# EasyEDA Pro project Schematics with ESP32 .eprj

# Schematic Schematic1

## Sheets
1 Part B(1): Board Name: Board1; Create Date: 2026-05-07; Page Name: P1; Project Name: Schematics with ESP32; Schematic Name: Schematic1; Update Date: 2026-05-08; Company: EasyEDA.com; Page Size: A4; Version: V1.0
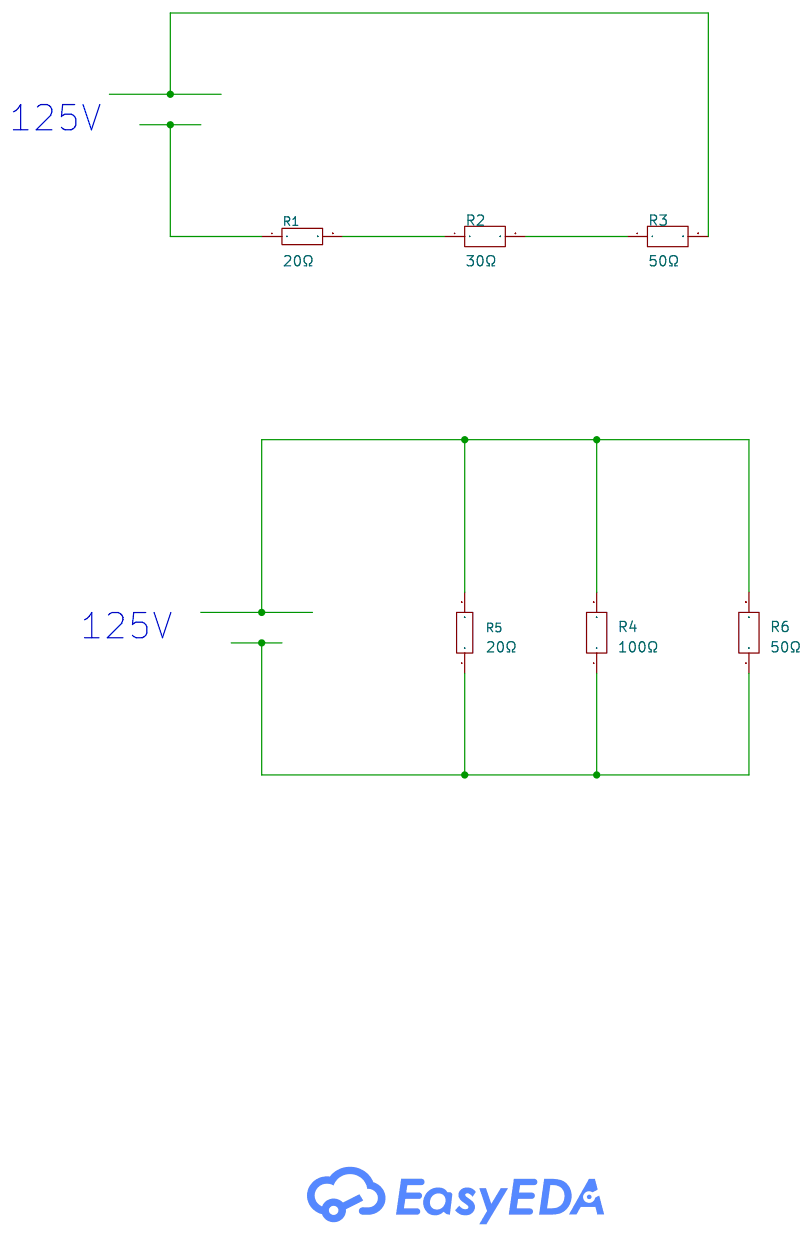
[diagram p0: Part B(1)]
2 Part B(2): Create Date: 2026-05-10; Page Name: Part B(2); Update Date: 2026-05-11
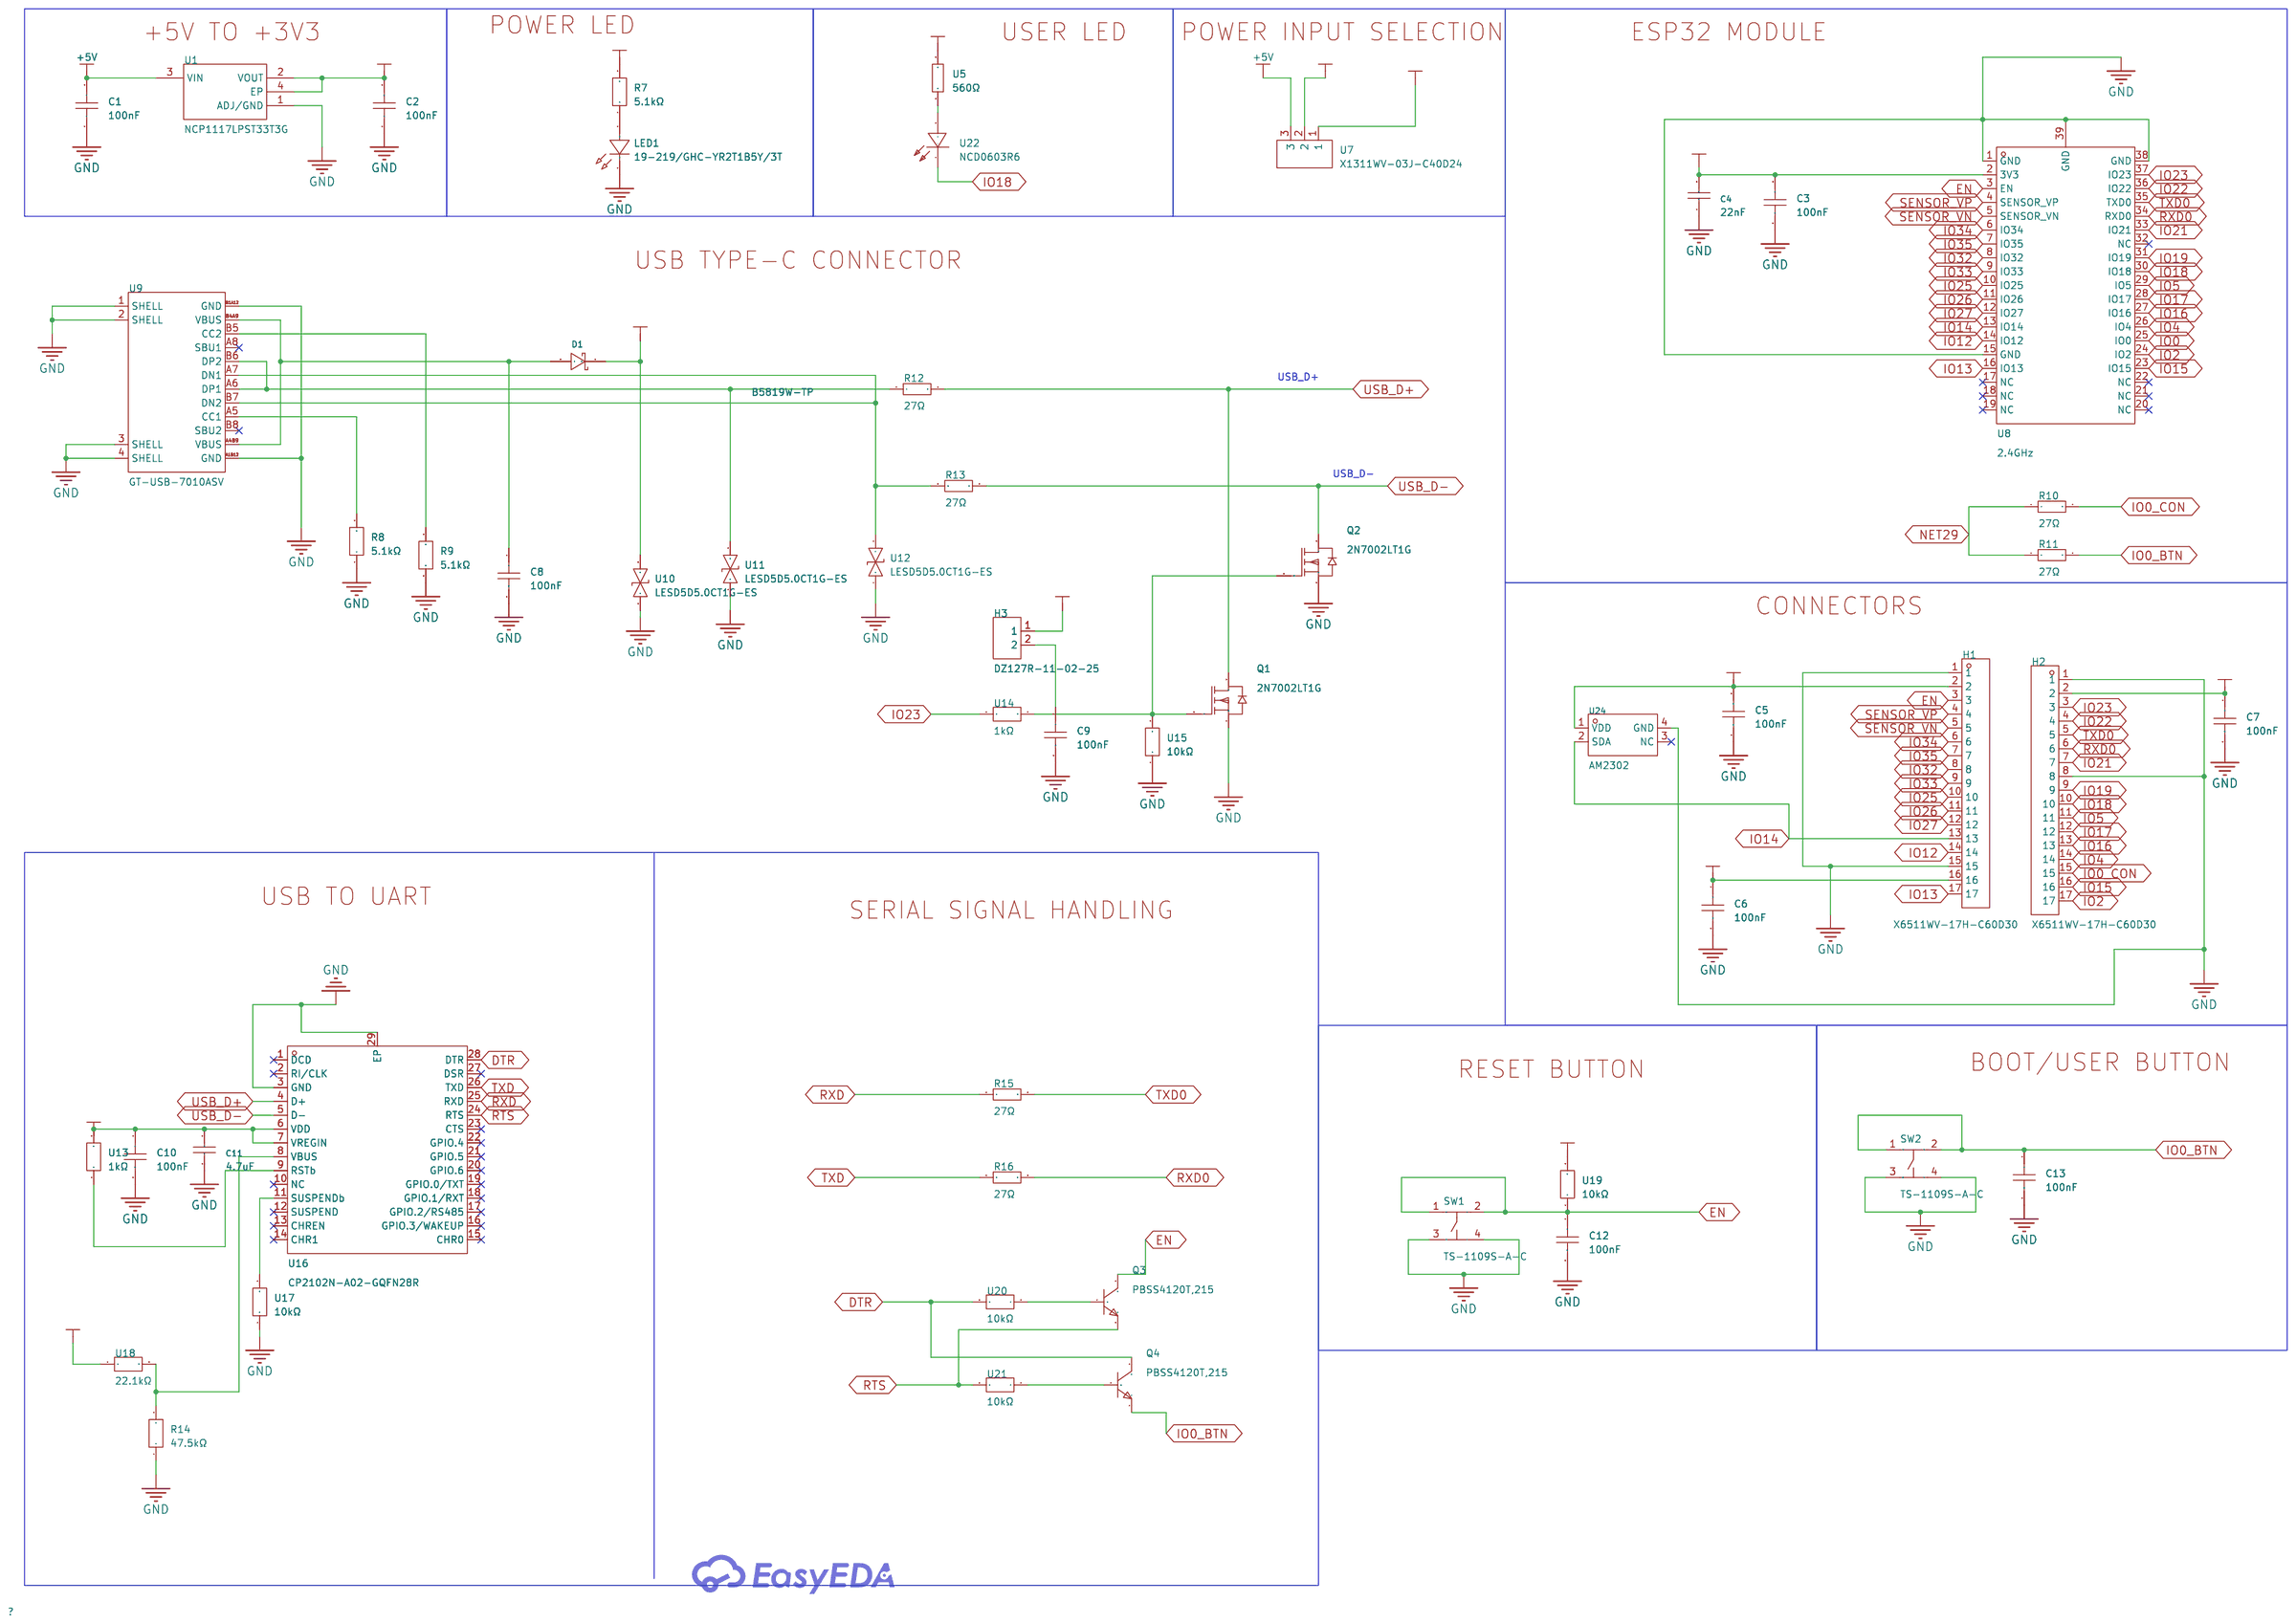
[diagram p1: Part B(2)]

## Parts
sheet Part B(1)
R1  20Ω  [R0805]
R2  30Ω  [R0805]
R3  50Ω  [R0805]
R4  100Ω  [R0805]
R5  20Ω  [R0603]
R6  50Ω  [R0805]
sheet Part B(2)
C1  100nF  [C0603]
C2  100nF  [C0603]
C3  100nF  [C0603]
C4  22nF  [C0603]
C5  100nF  [C0603]
C6  100nF  [C0603]
C7  100nF  [C0603]
C8  100nF  [C0603]
C9  100nF  [C0603]
C10  100nF  [C0603]
C11  4.7uF  [C0603]
C12  100nF  [C0603]
C13  100nF  [C0603]
D1  B5819W-TP  [SOD-123_L2.8-W1.8-LS3.7-RD]
H1  X6511WV-17H-C60D30  [HDR-TH_17P-P2.54-V-M]
H2  X6511WV-17H-C60D30  [HDR-TH_17P-P2.54-V-M]
H3  DZ127R-11-02-25  [HDR-TH_2P-P1.27-V-M]
LED1  19-219/GHC-YR2T1B5Y/3T  [LED-SMD_L1.6-W0.8_19-219-GHC-YR2T1B5Y-3T]
Q1  2N7002LT1G  [SOT-23_L2.9-W1.3-P1.90-LS2.4-BR]
Q2  2N7002LT1G  [SOT-23_L2.9-W1.3-P1.90-LS2.4-BR]
Q3  PBSS4120T,215  [SOT-23-3_L2.9-W1.3-P1.90-LS2.4-BR]
Q4  PBSS4120T,215  [SOT-23-3_L2.9-W1.3-P1.90-LS2.4-BR]
R7  5.1kΩ  [RES-TH_BD4.5-L11.5-P15.50-D0.7]
R8  5.1kΩ  [RES-TH_BD4.5-L11.5-P15.50-D0.7]
R9  5.1kΩ  [RES-TH_BD4.5-L11.5-P15.50-D0.7]
R10  27Ω  [RES-TH_BD4.0-L11.5-P15.50-D0.7]
R11  27Ω  [RES-TH_BD4.0-L11.5-P15.50-D0.7]
R12  27Ω  [RES-TH_BD4.0-L11.5-P15.50-D0.7]
R13  27Ω  [RES-TH_BD4.0-L11.5-P15.50-D0.7]
R14  47.5kΩ  [RES-TH_BD2.4-L6.3-P10.30-D0.6]
R15  27Ω  [RES-TH_BD4.0-L11.5-P15.50-D0.7]
R16  27Ω  [RES-TH_BD4.0-L11.5-P15.50-D0.7]
SW1  TS-1109S-A-C  [KEY-SMD_4P-L4.5-W4.5-P3.00-LS7.0]
SW2  TS-1109S-A-C  [KEY-SMD_4P-L4.5-W4.5-P3.00-LS7.0]
U1  NCP1117LPST33T3G  [SOT-223_L6.5-W3.5-P2.30-LS7.0-BR]
U5  560Ω  [RES-TH_BD4.5-L11.5-P15.50-D0.8]
U7  X1311WV-03J-C40D24  [HDR-TH_3P-P1.27-V-M]
U8  2.4GHz  [WIFI-SMD_ESP32-WROOM-32E]
U9  GT-USB-7010ASV  [LED0805-FD_KSM0508PT24MIL]
U10  LESD5D5.0CT1G-ES  [SOD-523_L1.2-W0.8-LS1.6-BI]
U11  LESD5D5.0CT1G-ES  [SOD-523_L1.2-W0.8-LS1.6-BI]
U12  LESD5D5.0CT1G-ES  [SOD-523_L1.2-W0.8-LS1.6-BI]
U13  1kΩ  [RES-TH_BD4.5-L11.5-P15.50-D0.6]
U14  1kΩ  [RES-TH_BD4.5-L11.5-P15.50-D0.6]
U15  10kΩ  [RES-TH_2P-L22.0-W9.5-BL]
U16  CP2102N-A02-GQFN28R  [QFN-28_L5.0-W5.0-P0.50-TL-EP3.3]
U17  10kΩ  [RES-TH_2P-L22.0-W9.5-BL]
U18  22.1kΩ  [RES-TH_BD3.2-L9.0-P13.00-D0.5]
U19  10kΩ  [RES-TH_2P-L22.0-W9.5-BL]
U20  10kΩ  [RES-TH_2P-L22.0-W9.5-BL]
U21  10kΩ  [RES-TH_2P-L22.0-W9.5-BL]
U22  NCD0603R6  [LED0805-RD_RED]
U24  AM2302  [SENSOR-TH_AM2302]

## Library data of the parts
R1 = 0805W8J0200T5E: LCSC Part Name: 20Ω ±5% 125mW 厚膜电阻; Supplier Part: C25293; Manufacturer: UNI-ROYAL(厚声); Supplier Footprint: 0805; JLCPCB Part Class: Extended Part; Datasheet: https://item.szlcsc.com/datasheet/0805W8J0200T5E/26036.html; Supplier: LCSC; Type: Thick Film Resistor; Tolerance: ±5%; Power(Watts): 125mW; Voltage-Supply(Max): 150V; Temperature Coefficient: ±200ppm/℃; Operating Temperature: -55℃~+155℃
R2 = FRC0805F30R0TS: LCSC Part Name: 30Ω ±1% 125mW 厚膜电阻; Supplier Part: C2907256; Manufacturer: FOJAN(富捷); Supplier Footprint: 0805; JLCPCB Part Class: Extended Part; Supplier: LCSC; Type: Thick Film Resistor; Tolerance: ±1%; Power(Watts): 125mW; Voltage-Supply(Max): 150V; Temperature Coefficient: ±100ppm/℃; Operating Temperature: -55℃~+155℃
R3 R6 = ARG05FTC0500: LCSC Part Name: 薄膜电阻 50Ω ±1% 125mW; Supplier Part: C2828866; Manufacturer: Viking(光颉); Supplier Footprint: 0805; JLCPCB Part Class: Extended Part; Datasheet: https://atta.szlcsc.com/upload/public/pdf/source/20211009/C2828883_CAE7D170B8B230FC4A048BDC7B3A81FC.pdf; Supplier: LCSC; Type: Thin Film Resistor; Tolerance: ±1%; Temperature Coefficient: ±25ppm/℃; Operating Temperature Range: -55℃~+155℃
R4 = FRC0805J101 TS: LCSC Part Name: 100Ω ±5% 125mW 厚膜电阻; Supplier Part: C2907294; Manufacturer: FOJAN(富捷); Supplier Footprint: 0805; JLCPCB Part Class: Extended Part; Supplier: LCSC; Type: Thick Film Resistor; Tolerance: ±5%; Power(Watts): 125mW; Voltage-Supply(Max): 150V; Temperature Coefficient: ±100ppm/℃; Operating Temperature: -55℃~+155℃
R5 = 0603WAF200JT5E: LCSC Part Name: 20Ω ±1% 100mW 厚膜电阻; Supplier Part: C22950; Manufacturer: UNI-ROYAL(厚声); Supplier Footprint: 0603; JLCPCB Part Class: Basic Part; Datasheet: https://atta.szlcsc.com/upload/public/pdf/source/20200306/C422600_1E6D84923E4A46A82E41ADD87F860B5C.pdf; Supplier: LCSC; Type: Thick Film Resistors; Tolerance: ±1%; Temperature Coefficient: ±100ppm/℃; Operating Temperature Range: -55℃~+155℃
C1-C3 C5-C10 C12 C13 = CAP_0603: Supplier Footprint: 0603
C4 = CL10B223KB8NNNC: LCSC Part Name: 22nF ±10% 50V; Supplier Part: C21122; Manufacturer: SAMSUNG(三星); Supplier Footprint: 0603; JLCPCB Part Class: Basic Part; Datasheet: https://item.szlcsc.com/datasheet/CL10B223KB8NNNC/21834.html; Supplier: LCSC; Tolerance: ±10%; Voltage Rating: 50V; Temperature Coefficient: X7R
C11 = CL10A475KP8NNNC: LCSC Part Name: 4.7uF ±10% 10V; Supplier Part: C1705; Manufacturer: SAMSUNG(三星); Supplier Footprint: 0603; JLCPCB Part Class: Extended Part; Datasheet: https://item.szlcsc.com/datasheet/CL10A475KP8NNNC/2057.html; Supplier: LCSC; Tolerance: ±10%; Voltage Rating: 10V; Temperature Coefficient: X5R
D1 = B5819W-TP: LCSC Part Name: 电压:40V 电流:1A; Supplier Part: C84354; Manufacturer: MCC(美微科); Supplier Footprint: SOD-123; JLCPCB Part Class: Extended Part; Datasheet: https://item.szlcsc.com/datasheet/B5819W-TP/85524.html; Supplier: LCSC; Voltage - Forward(Vf@If): 600mV@1A; Voltage - DC Reverse(Vr): 40V; Current - Rectified: 1A; Reverse Leakage Current (Ir): 1mA@40V; Operating Junction Temperature Range: -65℃~+125℃; Non-Repetitive Peak Forward Surge Current: 10A
H1 H2 = X6511WV-17H-C60D30: LCSC Part Name: 1x17P 间距:2.54mm 方针; Supplier Part: C725949; Manufacturer: XKB Connection(中国星坤); Supplier Footprint: 插件,P=2.54mm; JLCPCB Part Class: Extended Part; Datasheet: https://item.szlcsc.com/datasheet/X6511WV-17H-C60D30/772398.html; Supplier: LCSC; Pin Structure: 1x17P; Pitch: 2.54mm; Row Spacing: 2.54mm; Circluar Pins/Square Pins: Pin Header; Number of Rows: 1; Number of Pins: 17P; Current Rating: 3A; Voltage Rating (Max): 250V; Insulation Height: 2.5mm; Contact Material: Brass; Contact Plating: Gold; Operating Temperature: -40℃~+105℃; Color: Black
H3 = DZ127R-11-02-25: LCSC Part Name: 1x2P 间距:1.27mm 方针 直插; Supplier Part: C2935942; Manufacturer: DEALON(德艺隆); Supplier Footprint: 插件,P=1.27mm; JLCPCB Part Class: Extended Part; Datasheet: https://item.szlcsc.com/datasheet/DZ127R-11-02-25/3287520.html; Supplier: LCSC; Pin Structure: 1x2P; Pitch: 1.27mm; Circluar Pins/Square Pins: Pin Header; Mounting Type: Through Hole; Number of Rows: 1; Number of Pins: 2P; Current Rating: 1A; Length of Mating Pin: 3mm; Insulation Height: 1mm; Length of End Connection Pin: 2.5mm; Contact Material: Brass; Contact Plating: Gold; Color: Black
LED1 = 19-219/GHC-YR2T1B5Y/3T: LCSC Part Name: 0603正贴式 绿灯(Iv=140~360mcd) @IF=20mA); Supplier Part: C2994781; Manufacturer: EVERLIGHT(亿光); Supplier Footprint: 0603; JLCPCB Part Class: Extended Part; Datasheet: https://www.everlighteurope.com/custom/files/datasheets/DSE-0006814.pdf; Supplier: LCSC; Illumination Color: Green; Voltage - Forward(Vf): 2.9V; Power(Watts): 95mW; Forward Current: 5mA; Wavelength - Dominant: 518nm; Peak Wavelength: 525nm; Diode Configuration: Discrete Diode; Lens Color: Water Clear; Luminous Intensity: 360mcd; Viewing Angle: 130°; Operating Temperature: -40℃~+85℃
Q1 Q2 = 2N7002LT1G: LCSC Part Name: 1个N沟道 耐压:60V 电流:115mA; Supplier Part: C16338; Manufacturer: onsemi(安森美); Supplier Footprint: SOT-23; JLCPCB Part Class: Extended Part; Datasheet: https://atta.szlcsc.com/upload/public/pdf/source/20140815/1457707218098.pdf; Supplier: LCSC; Type: 1 N-Channel; Drain Source On Resistance (RDS(on)@Vgs,Id): 7.5Ω@10V,500mA; Gate Threshold Voltage (Vgs(th)@Id): 2.5V@250uA; Input Capacitance (Ciss@Vds): 50pF@25V; Reverse Transfer Capacitance (Crss@Vds): 5pF@25V; Operating Temperature: -55℃~+150℃
Q3 Q4 = PBSS4120T,215: LCSC Part Name: NPN 电流:1A 电压:20V; Supplier Part: C455069; Manufacturer: Nexperia(安世); Supplier Footprint: SOT-23; JLCPCB Part Class: Extended Part; Datasheet: https://item.szlcsc.com/datasheet/PBSS4120T%252C215/457438.html; Supplier: LCSC; type: NPN; Current - Collector(Ic): 1A; Collector - Emitter Voltage VCEO: 20V; Pd - Power Dissipation: 480mW; DC Current Gain: 300@500mA,2V; Transition frequency(fT): 100MHz; Current - Collector Cutoff: 50uA; Vce Saturation(VCE(sat)): 250mV@1A,50mA; Operating Temperature: -65℃~+150℃; Emitter-Base Voltage(Vebo): 5V; Number: 1 NPN
R7-R9 = MF1W-5.1KΩ±1%T: LCSC Part Name: 金属膜电阻 5.1kΩ ±1% 1W; Supplier Part: C714111; Manufacturer: 华星机电; Supplier Footprint: 插件,D4.5xL11.5mm; JLCPCB Part Class: Extended Part; Datasheet: https://item.szlcsc.com/datasheet/MF1W-5.1K%25CE%25A9%25C2%25B11%2525T/754436.html; Supplier: LCSC; Type: Metal Film Resistor; Tolerance: ±1%; Power(Watts): 1W; Temperature Coefficient: ±200ppm/℃
R10-R13 R15 R16 = MF2WS-27Ω±1%: LCSC Part Name: 27Ω ±1% 2W 金属膜电阻; Supplier Part: C127253; Manufacturer: CCO(千志电子); Supplier Footprint: 插件,D4.5xL11.5mm; JLCPCB Part Class: Extended Part; Datasheet: https://atta.szlcsc.com/upload/public/pdf/source/20190910/C427326_62A6D058BC0FF74963A2F22379CA06CE.pdf; Supplier: LCSC; Type: Metal Film Resistors; Tolerance: ±1%; Voltage-Supply(Max): 350V; Power(Watts): 2W; Temperature Coefficient: ±100ppm/℃; Operating Temperature: -55℃~+155℃
R14 = RNF14BTC47K5: LCSC Part Name: 金属膜电阻 47.5kΩ ±0.1% 250mW; Supplier Part: C2592088; Manufacturer: SEI(Stackpole Electronics Inc.); Supplier Footprint: 插件,D2.4xL6.4mm; JLCPCB Part Class: Extended Part; Datasheet: https://atta.szlcsc.com/upload/public/pdf/source/20210416/CE3C3DFE1F0E2A8D22EC743938724C43.pdf; Supplier: LCSC; Type: Metal Film Resistors; Tolerance: ±0.1%; Power(Watts): 0.25W; Temperature Coefficient: ±50ppm/℃; Operating Temperature Range: -55℃~+155℃
SW1 SW2 = TS-1109S-A-C: LCSC Part Name: 4.5*4.5*4.5mm 立贴 轻触开关; Supplier Part: C2885142; Manufacturer: XKB Connection(中国星坤); Supplier Footprint: SMD-4P,4.5x4.5mm; JLCPCB Part Class: Extended Part; Datasheet: https://item.szlcsc.com/datasheet/TS-1109S-A-C/3095634.html; Supplier: LCSC; Circuit: SPST; Actuator Style: Round Button; Operating Force: 1N; Mounting Type: Surface Mount,Vertical; Length: 4.5mm; Width: 4.5mm; Switch Height: 4.5mm; with Bracket: Without Bracket; Contact Current: 50mA; Voltage Rating: 12V; Actuator/Cap Color: Black; With Lamp: No; Termination Style: Gull Wing; Life: 100,000 cycles; Operating Temperature: -30℃~+85℃
U1 = NCP1117LPST33T3G: LCSC Part Name: 输入18V 输出3.3V 1A; Supplier Part: C146799; Manufacturer: onsemi(安森美); Supplier Footprint: SOT-223; JLCPCB Part Class: Extended Part; Datasheet: https://item.szlcsc.com/datasheet/NCP1117LPST33T3G/158131.html; Supplier: LCSC; Output Type: Fixed; Voltage - Supply: 18V; Output Voltage: 3.3V; Output Current: 1A; Power Supply Rejection Ratio (PSRR): 60dB@(120Hz); Voltage Dropout: 1.3V@(1A); standby current: 550uA; Features: Over Temperature Protection；Over Current Protection; Operating Temperature: 0℃~+125℃; Output Configuration: Positive; Number of Outputs: 1
U5 = MF1W-560Ω±1% T: LCSC Part Name: 560Ω ±1% 1W 金属膜电阻; Supplier Part: C119480; Manufacturer: CCO(千志电子); Supplier Footprint: 插件,D4.5xL11.5mm; JLCPCB Part Class: Extended Part; Datasheet: https://item.szlcsc.com/datasheet/MF1W-560%25CE%25A9%25C2%25B11%2525%2520T/120749.html; Supplier: LCSC; Type: Metal Film Resistor; Tolerance: ±1%; Voltage-Supply(Max): 350V; Power(Watts): 1W; Temperature Coefficient: ±100ppm/℃; Operating Temperature: -55℃~+155℃
U7 = X1311WV-03J-C40D24: LCSC Part Name: 1x3P 间距:1.27mm 方针; Supplier Part: C5243683; Manufacturer: XKB Connection(中国星坤); Supplier Footprint: 插件,P=1.27mm; JLCPCB Part Class: Extended Part; Datasheet: https://item.szlcsc.com/datasheet/X1311WV-03J-C40D24/5952616.html; Supplier: LCSC; Pin Structure: 1x3P; Pitch: 1.27mm; Row Spacing: 1.27mm; Circluar Pins/Square Pins: Pin Header; Number of Rows: 1; Number of Pins: 3P; Current Rating: 3A; Voltage Rating (Max): 250V; Insulation Height: 1mm; Contact Material: Brass; Contact Plating: Gold; Operating Temperature: -40℃~+105℃; Color: Black
U8 = ESP32-WROOM-32E-N8: LCSC Part Name: 不带固件 通用型Wi-Fi+BT+BLE MCU模组; Supplier Part: C701342; Manufacturer: ESPRESSIF(乐鑫); Supplier Footprint: SMD,25.5x18mm; JLCPCB Part Class: Extended Part; Datasheet: https://item.szlcsc.com/datasheet/ESP32-WROOM-32E-N8/736350.html; Supplier: LCSC; Utilized IC / Part: ESP32-DOWD-V3; Wireless Standard: Bluetooth4.2; Interface Type: I2C；GPIO；UART；SPI；PWM；SDIO；I2S; Antenna Type: On-board PCB Antenna; Output Power: 20dBm; Voltage - Supply: 3V~3.6V; Receive  Current: 112mA; Send  Current: 239mA; Sensitivity: -98dBm; Operating Temperature: -40℃~+85℃
U9 = GT-USB-7010ASV: LCSC Part Name: Type-C 母 卧贴; Supplier Part: C2988369; Manufacturer: G-Switch(品赞); Supplier Footprint: SMD; JLCPCB Part Class: Extended Part; Datasheet: https://item.szlcsc.com/datasheet/GT-USB-7010ASV/3445595.html; Supplier: LCSC; Connector Type: Type-C; Protocol Standard: USB 2.0; Gender: Female; Mounting Type: Surface Mount, Right Angle; Number of Contacts: 16P; Number of Ports: 1; Current Rating-Power: 3A; Voltage Rating: 24V; Connect-Disconnect Life: 10,000 cycles; Center Height: 1.68mm; Length: 7.35mm; Detection color: Black; Operating Temperature: -40℃~+85℃
U10-U12 = LESD5D5.0CT1G-ES: LCSC Part Name: 普容5.0V，单路双向ESD静电防护器件，30kV，CJ：12pF；音频/视频/通讯防护; Supplier Part: C5199159; Manufacturer: ElecSuper(静芯微); Supplier Footprint: SOD523; JLCPCB Part Class: Extended Part; Datasheet: https://atta.szlcsc.com/upload/public/pdf/source/20240905/10776531C4DE5F6ADA679023752259EC.pdf; Supplier: LCSC; polarity: Bidirectional; Reverse Stand-Off Voltage (Vrwm): 5V; Maximum Clamping Voltage: 10V; Peak Pulse Current (Ipp): 8A; Peak Pulse Power Dissipation (Ppp): 80W; Breakdown Voltage: 5.8V; Reverse Leakage Current (Ir): 1uA; Number of Lines: Single channel; Type: ESD
U13 U14 = CF1W-1KΩ±5%T: LCSC Part Name: 碳膜电阻 1kΩ ±5% 1W; Supplier Part: C714362; Manufacturer: 华星机电; Supplier Footprint: 插件,D4.5xL11.5mm; JLCPCB Part Class: Extended Part; Datasheet: https://item.szlcsc.com/datasheet/CF1W-1K%25CE%25A9%25C2%25B15%2525T/754687.html; Supplier: LCSC; Type: Carbon Film Resistor; Tolerance: ±5%; Power(Watts): 1W; Temperature Coefficient: -1500ppm/℃~+300ppm/℃
U15 U17 U19-U21 = CR-L5W10KΩJ: LCSC Part Name: 水泥电阻 10kΩ ±5% 5W; Supplier Part: C714743; Manufacturer: 华星机电; Supplier Footprint: 插件,D9.5xL22mm; JLCPCB Part Class: Extended Part; Datasheet: https://item.szlcsc.com/datasheet/CR-L5W10K%25CE%25A9J/755068.html; Supplier: LCSC; Type: Cement Resistor; Tolerance: ±5%; Voltage-Supply(Max): 750V; Power(Watts): 5W; Temperature Coefficient: -1500ppm/℃~+300ppm/℃; Operating Temperature: -55℃~+250℃
U16 = CP2102N-A02-GQFN28R: LCSC Part Name: USB转UART桥接器; Supplier Part: C964632; Manufacturer: SKYWORKS/SILICON LABS(芯科); Supplier Footprint: QFN-28-EP(5x5); JLCPCB Part Class: Extended Part; Datasheet: https://item.szlcsc.com/datasheet/CP2102N-A02-GQFN28R/1049893.html; Supplier: LCSC; Applications Function: USB to UART; USB Protocol: USB 2.0; Voltage - Supply: 3V~3.6V; Operating Temperature: -40℃~+85℃@(Ta); Current - Supply: 9.5mA; Quiescent Supply Current: 1.3uA
U18 = RSMF1FT22K1: LCSC Part Name: 金属氧化膜电阻 22.1kΩ ±1% 1W; Supplier Part: C2590508; Manufacturer: SEI(Stackpole Electronics Inc.); Supplier Footprint: 插件,D3.2xL9mm; JLCPCB Part Class: Extended Part; Datasheet: https://atta.szlcsc.com/upload/public/pdf/source/20210417/E7D670218B9E9D0CE2FA9103C376073D.pdf; Supplier: LCSC; Type: Metal Oxide Resistors; Tolerance: ±1%; Power(Watts): 1W; Temperature Coefficient: ±200ppm/℃; Operating Temperature Range: -55℃~+200℃
U22 = NCD0603R6: LCSC Part Name: 片式发光二极管; Supplier Part: C7429910; Manufacturer: 国星光电; Supplier Footprint: 0603; JLCPCB Part Class: Extended Part; Datasheet: https://item.szlcsc.com/datasheet/NCD0603R6/8428631.html; Supplier: LCSC; Illumination Color: Red; Voltage - Forward(Vf): 1.6V~2.4V; Power(Watts): 65mW; Forward Current: 25mA; Wavelength - Dominant: 620nm~630nm; Peak Wavelength: 630nm; Diode Configuration: Discrete Diode; Luminous Intensity: 80mcd; Viewing Angle: 140°; Operating Temperature: -30℃~+85℃
U24 = AM2302_C55447: Supplier Part: C55447; Manufacturer: 广州奥松; Supplier Footprint: 插件; JLCPCB Part Class: Extended Part; Datasheet: https://atta.szlcsc.com/upload/public/pdf/source/20150811/1457707344116.pdf; Supplier: LCSC

## Nets
+3V3: C2.1 C3.1 C4.2 C5.1 C7.1 C10.1 C11.2 H1.2 H2.2 H3.1 R7.2 U1.2(VOUT) U1.4(EP) U5.2 U8.2(3V3) U13.2 U16.6(VDD) U16.7(VREGIN) U19.2 U24.1(VDD)
+5V: C1.1 U1.3(VIN) U7.3
+5V_EXT: C6.1 H1.16 U7.2
+5V_VBUS: D1.1(C) U7.1 U10.2 U18.1
GND: C1.2 C2.2 C3.2 C4.1 C5.2 C6.2 C7.2 C8.2 C9.2 C10.2 C11.1 C12.2 C13.2 H1.1 H1.15 H2.1 H2.8 LED1.2(K) Q1.2(S) Q2.2(S) R8.1 R9.1 R14.1 SW1.3 SW1.4 SW2.3 SW2.4 U1.1(ADJ/GND) U8.1(GND) U8.15(GND) U8.38(GND) U8.39(GND) U9.1(SHELL) U9.2(SHELL) U9.3(SHELL) U9.4(SHELL) U9.A1B12(GND) U9.B1A12(GND) U10.1 U11.1 U12.1 U15.1 U16.3(GND) U16.29(EP) U17.1 U24.4(GND)
DTR: Q4.3(C) U16.28(DTR) U20.2
EN: C12.1 H1.3 Q3.3(C) SW1.1 SW1.2 U8.3(EN) U19.1
IO0: U8.25(IO0)
IO0_BTN: C13.1 Q4.2(E) R11.2 SW2.1 SW2.2
IO0_CON: H2.15 R10.2
IO2: H2.17 U8.24(IO2)
IO4: H2.14 U8.26(IO4)
IO5: H2.11 U8.29(IO5)
IO12: H1.14 U8.14(IO12)
IO13: H1.17 U8.16(IO13)
IO14: H1.13 U8.13(IO14) U24.2(SDA)
IO15: H2.16 U8.23(IO15)
IO16: H2.13 U8.27(IO16)
IO17: H2.12 U8.28(IO17)
IO18: H2.10 U8.30(IO18) U22.1(-)
IO19: H2.9 U8.31(IO19)
IO21: H2.7 U8.33(IO21)
IO22: H2.4 U8.36(IO22)
IO23: H2.3 U8.37(IO23) U14.1
IO25: H1.10 U8.10(IO25)
IO26: H1.11 U8.11(IO26)
IO27: H1.12 U8.12(IO27)
IO32: H1.8 U8.8(IO32)
IO33: H1.9 U8.9(IO33)
IO34: H1.6 U8.6(IO34)
IO35: H1.7 U8.7(IO35)
NET29: R10.1 R11.1
RTS: Q3.2(E) U16.24(RTS) U21.2
RXD: R15.1 U16.25(RXD)
RXD0: H2.6 R16.2 U8.34(RXD0)
SENSOR_VN: H1.5 U8.5(SENSOR_VN)
SENSOR_VP: H1.4 U8.4(SENSOR_VP)
TXD: R16.1 U16.26(TXD)
TXD0: H2.5 R15.2 U8.35(TXD0)
USB_D+: Q1.3(D) R12.2 U16.4(D+)
USB_D-: Q2.3(D) R13.1 U16.5(D-)
Net-(C8-1): C8.1 D1.2(A) U9.A4B9(VBUS) U9.B4A9(VBUS)
Net-(C9-1): C9.1 H3.2
Net-(LED1-1): LED1.1(A) R7.1
Net-(Q1-1): Q1.1(G) Q2.1(G) U14.2 U15.2
Net-(Q3-1): Q3.1(B) U20.1
Net-(Q4-1): Q4.1(B) U21.1
Net-(R1-2): R1.2 R2.1
Net-(R2-2): R2.2 R3.1
Net-(R4-1): R4.1 R5.1 R6.1
Net-(R4-2): R4.2 R5.2 R6.2
Net-(R8-2): R8.2 U9.A5(CC1)
Net-(R9-2): R9.2 U9.B5(CC2)
Net-(R12-1): R12.1 U9.A6(DP1) U9.B6(DP2) U11.2
Net-(R13-2): R13.2 U9.A7(DN1) U9.B7(DN2) U12.2
Net-(R14-2): R14.2 U16.8(VBUS) U18.2
Net-(U5-1): U5.1 U22.2(+)
Net-(U13-1): U13.1 U16.9(RSTb)
Net-(U16-11): U16.11(SUSPENDb) U17.2

Not connected (* = marked no-connect by the designer): R1 1; R3 2; U8 17(NC)* 18(NC)* 19(NC)* 20(NC)* 21(NC)* 22(NC)* 32(NC)*; U9 A8(SBU1)* B8(SBU2)*; U16 1(DCD)* 2(RI/CLK)* 10(NC)* 12(SUSPEND)* 13(CHREN)* 14(CHR1)* 15(CHR0)* 16(GPIO.3/WAKEUP)* 17(GPIO.2/RS485)* 18(GPIO.1/RXT)* 19(GPIO.0/TXT)* 20(GPIO.6)* 21(GPIO.5)* 22(GPIO.4)* 23(CTS)* 27(DSR)*; U24 3(NC)*

## Notes on the sheets
sheet 1
- 125V
- 125V
sheet 2
- +5V TO +3V3
- POWER LED
- USER LED
- POWER INPUT SELECTION
- ESP32 MODULE
- USB TYPE-C CONNECTOR
- USB_D+
- USB_D-
- CONNECTORS
- USB TO UART
- SERIAL SIGNAL HANDLING
- BOOT/USER BUTTON
- RESET BUTTON

# Schematic Schematic2
Board Name: Board1; Create Date: 2026-05-10; Page Name: Part B(2); Project Name: Schematics with ESP32; Schematic Name: Schematic1; Update Date: 2026-05-11; Company: EasyEDA.com; Page Size: A4; Version: V1.0
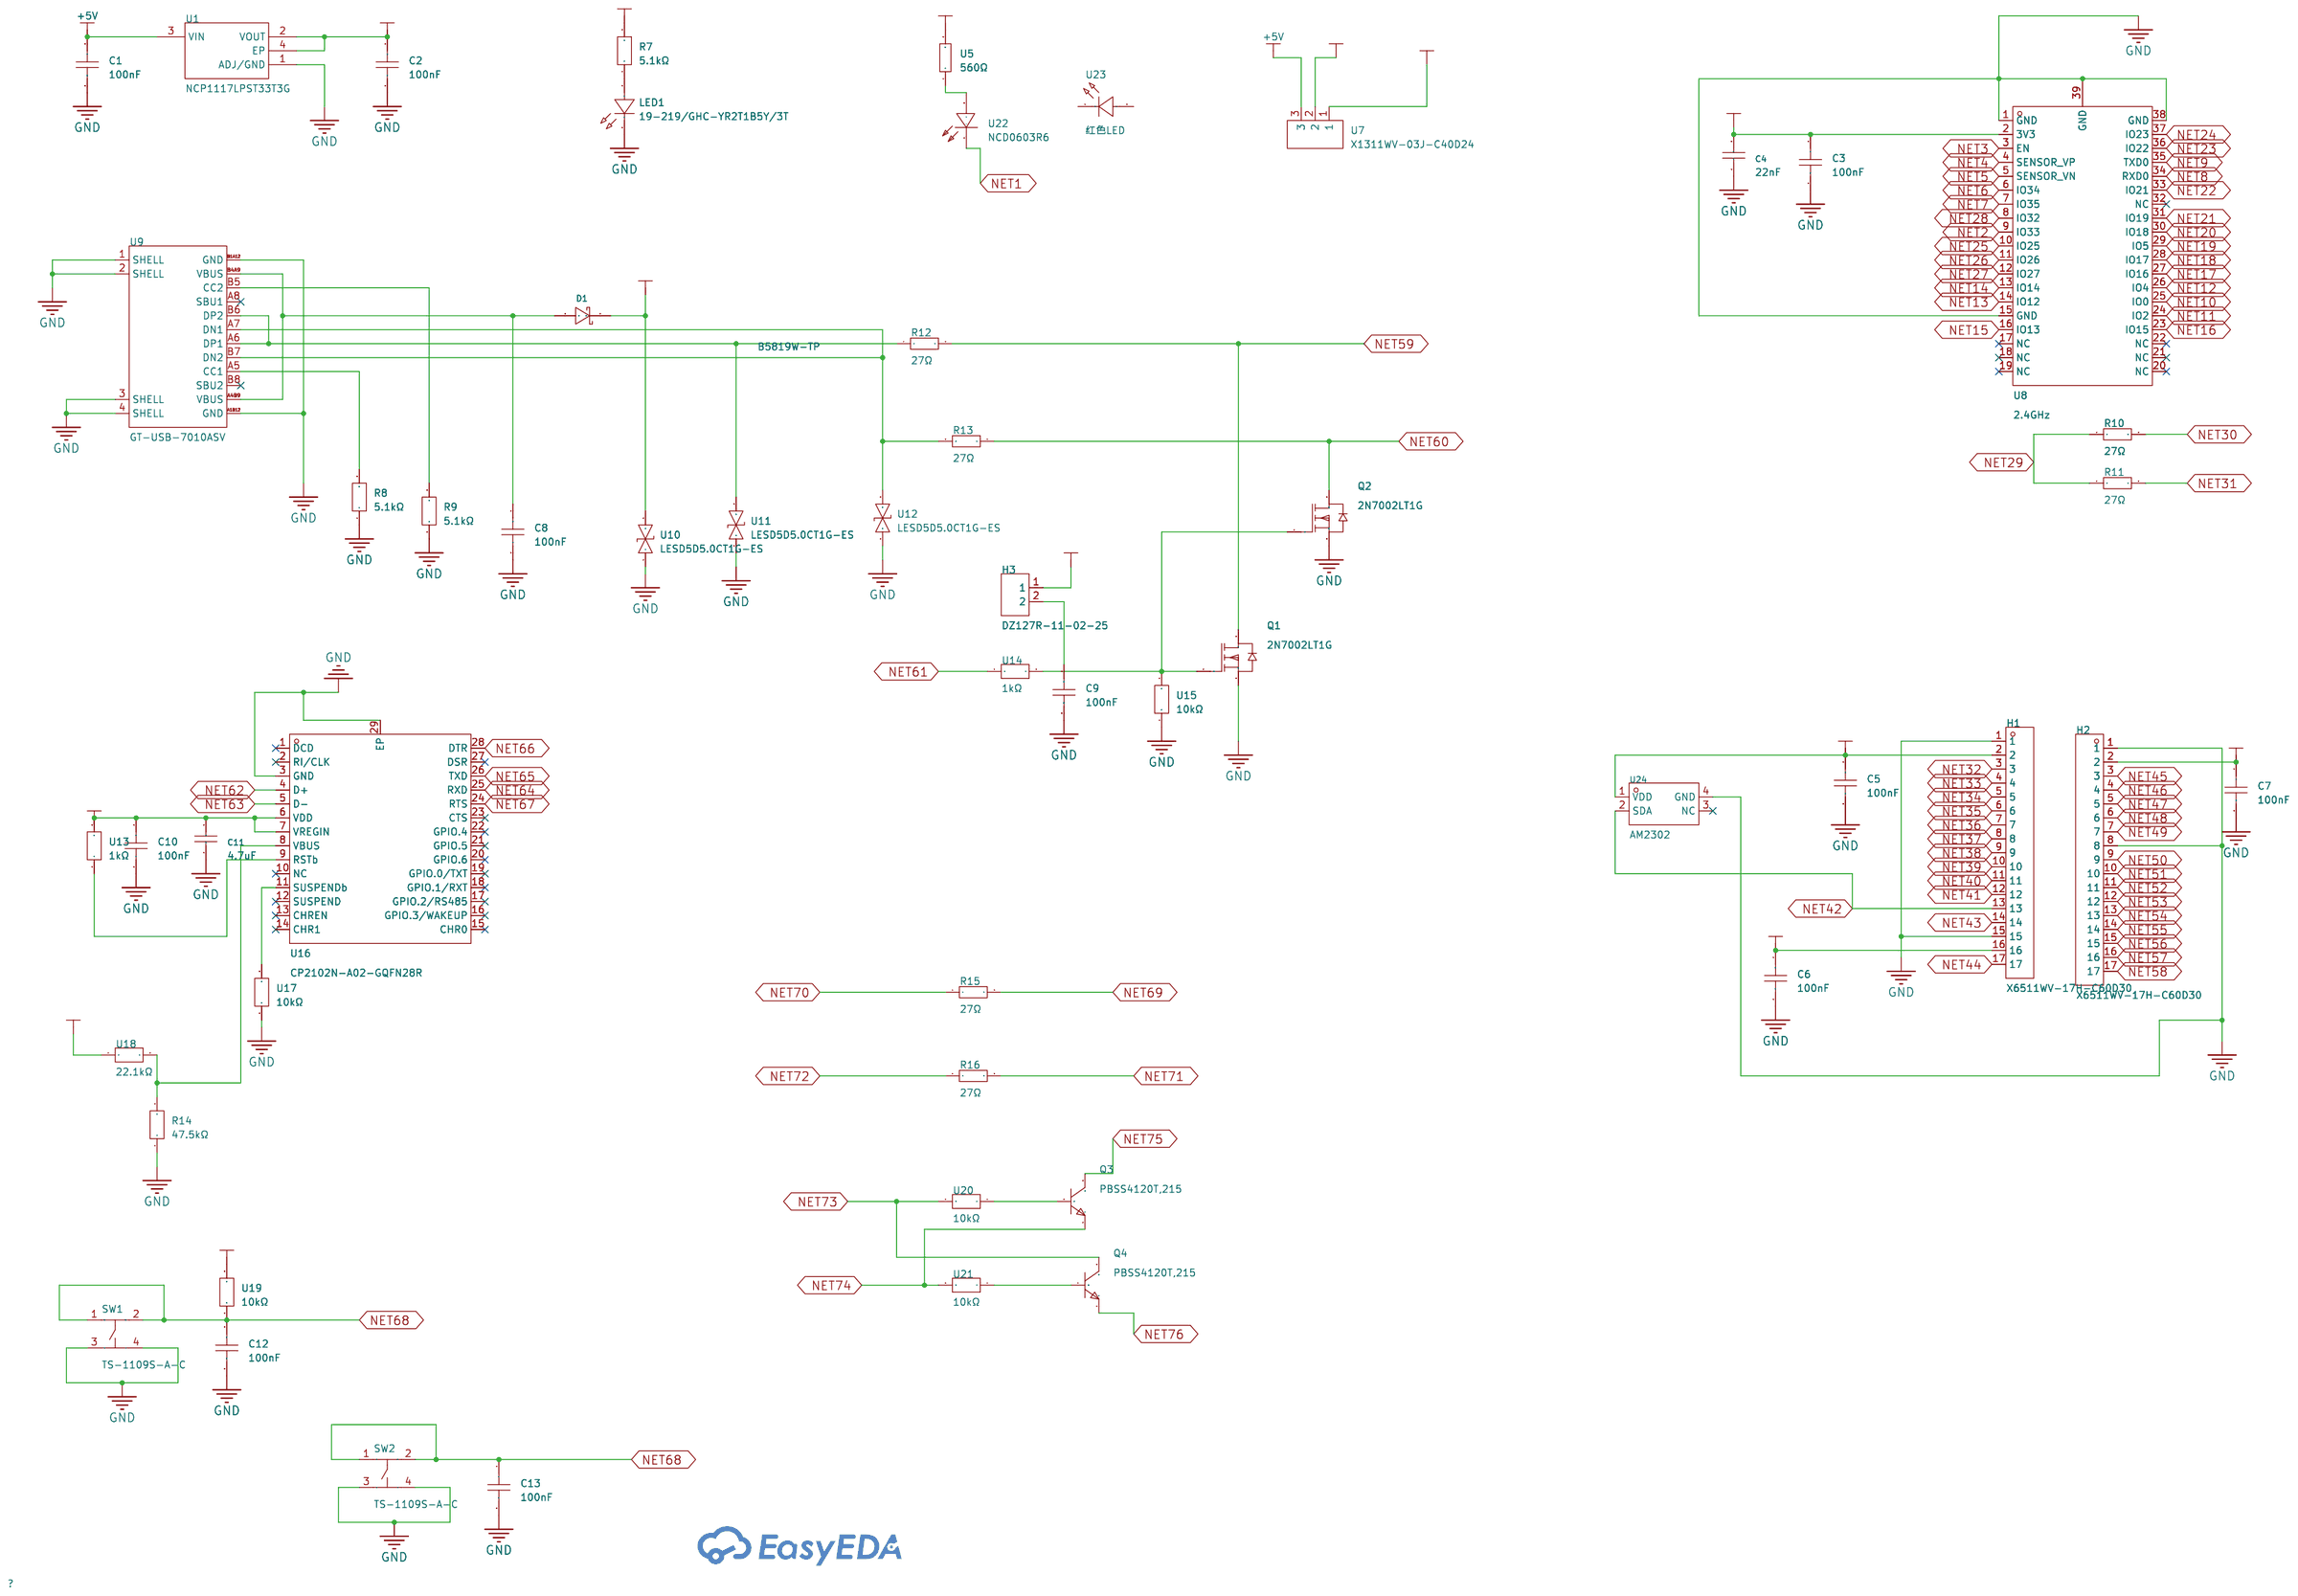
[diagram p2: schematic sheet]

## Parts
C1  100nF  [C0603]
C2  100nF  [C0603]
C3  100nF  [C0603]
C4  22nF  [C0603]
C5  100nF  [C0603]
C6  100nF  [C0603]
C7  100nF  [C0603]
C8  100nF  [C0603]
C9  100nF  [C0603]
C10  100nF  [C0603]
C11  4.7uF  [C0603]
C12  100nF  [C0603]
C13  100nF  [C0603]
D1  B5819W-TP  [SOD-123_L2.8-W1.8-LS3.7-RD]
H1  X6511WV-17H-C60D30  [HDR-TH_17P-P2.54-V-M]
H2  X6511WV-17H-C60D30  [HDR-TH_17P-P2.54-V-M]
H3  DZ127R-11-02-25  [HDR-TH_2P-P1.27-V-M]
LED1  19-219/GHC-YR2T1B5Y/3T  [LED-SMD_L1.6-W0.8_19-219-GHC-YR2T1B5Y-3T]
Q1  2N7002LT1G  [SOT-23_L2.9-W1.3-P1.90-LS2.4-BR]
Q2  2N7002LT1G  [SOT-23_L2.9-W1.3-P1.90-LS2.4-BR]
Q3  PBSS4120T,215  [SOT-23-3_L2.9-W1.3-P1.90-LS2.4-BR]
Q4  PBSS4120T,215  [SOT-23-3_L2.9-W1.3-P1.90-LS2.4-BR]
R7  5.1kΩ  [RES-TH_BD4.5-L11.5-P15.50-D0.7]
R8  5.1kΩ  [RES-TH_BD4.5-L11.5-P15.50-D0.7]
R9  5.1kΩ  [RES-TH_BD4.5-L11.5-P15.50-D0.7]
R10  27Ω  [RES-TH_BD4.0-L11.5-P15.50-D0.7]
R11  27Ω  [RES-TH_BD4.0-L11.5-P15.50-D0.7]
R12  27Ω  [RES-TH_BD4.0-L11.5-P15.50-D0.7]
R13  27Ω  [RES-TH_BD4.0-L11.5-P15.50-D0.7]
R14  47.5kΩ  [RES-TH_BD2.4-L6.3-P10.30-D0.6]
R15  27Ω  [RES-TH_BD4.0-L11.5-P15.50-D0.7]
R16  27Ω  [RES-TH_BD4.0-L11.5-P15.50-D0.7]
SW1  TS-1109S-A-C  [KEY-SMD_4P-L4.5-W4.5-P3.00-LS7.0]
SW2  TS-1109S-A-C  [KEY-SMD_4P-L4.5-W4.5-P3.00-LS7.0]
U1  NCP1117LPST33T3G  [SOT-223_L6.5-W3.5-P2.30-LS7.0-BR]
U5  560Ω  [RES-TH_BD4.5-L11.5-P15.50-D0.8]
U7  X1311WV-03J-C40D24  [HDR-TH_3P-P1.27-V-M]
U8  2.4GHz  [WIFI-SMD_ESP32-WROOM-32E]
U9  GT-USB-7010ASV  [LED0805-FD_KSM0508PT24MIL]
U10  LESD5D5.0CT1G-ES  [SOD-523_L1.2-W0.8-LS1.6-BI]
U11  LESD5D5.0CT1G-ES  [SOD-523_L1.2-W0.8-LS1.6-BI]
U12  LESD5D5.0CT1G-ES  [SOD-523_L1.2-W0.8-LS1.6-BI]
U13  1kΩ  [RES-TH_BD4.5-L11.5-P15.50-D0.6]
U14  1kΩ  [RES-TH_BD4.5-L11.5-P15.50-D0.6]
U15  10kΩ  [RES-TH_2P-L22.0-W9.5-BL]
U16  CP2102N-A02-GQFN28R  [QFN-28_L5.0-W5.0-P0.50-TL-EP3.3]
U17  10kΩ  [RES-TH_2P-L22.0-W9.5-BL]
U18  22.1kΩ  [RES-TH_BD3.2-L9.0-P13.00-D0.5]
U19  10kΩ  [RES-TH_2P-L22.0-W9.5-BL]
U20  10kΩ  [RES-TH_2P-L22.0-W9.5-BL]
U21  10kΩ  [RES-TH_2P-L22.0-W9.5-BL]
U22  NCD0603R6  [LED0805-RD_RED]
U23  红色LED  [LED-SMD_L2.2-W1.6-FD_G2016C]
U24  AM2302  [SENSOR-TH_AM2302]

## Library data of the parts
C1-C3 C5-C10 C12 C13 = CAP_0603: Supplier Footprint: 0603
C4 = CL10B223KB8NNNC: LCSC Part Name: 22nF ±10% 50V; Supplier Part: C21122; Manufacturer: SAMSUNG(三星); Supplier Footprint: 0603; JLCPCB Part Class: Basic Part; Datasheet: https://item.szlcsc.com/datasheet/CL10B223KB8NNNC/21834.html; Supplier: LCSC; Tolerance: ±10%; Voltage Rating: 50V; Temperature Coefficient: X7R
C11 = CL10A475KP8NNNC: LCSC Part Name: 4.7uF ±10% 10V; Supplier Part: C1705; Manufacturer: SAMSUNG(三星); Supplier Footprint: 0603; JLCPCB Part Class: Extended Part; Datasheet: https://item.szlcsc.com/datasheet/CL10A475KP8NNNC/2057.html; Supplier: LCSC; Tolerance: ±10%; Voltage Rating: 10V; Temperature Coefficient: X5R
D1 = B5819W-TP: LCSC Part Name: 电压:40V 电流:1A; Supplier Part: C84354; Manufacturer: MCC(美微科); Supplier Footprint: SOD-123; JLCPCB Part Class: Extended Part; Datasheet: https://item.szlcsc.com/datasheet/B5819W-TP/85524.html; Supplier: LCSC; Voltage - Forward(Vf@If): 600mV@1A; Voltage - DC Reverse(Vr): 40V; Current - Rectified: 1A; Reverse Leakage Current (Ir): 1mA@40V; Operating Junction Temperature Range: -65℃~+125℃; Non-Repetitive Peak Forward Surge Current: 10A
H1 H2 = X6511WV-17H-C60D30: LCSC Part Name: 1x17P 间距:2.54mm 方针; Supplier Part: C725949; Manufacturer: XKB Connection(中国星坤); Supplier Footprint: 插件,P=2.54mm; JLCPCB Part Class: Extended Part; Datasheet: https://item.szlcsc.com/datasheet/X6511WV-17H-C60D30/772398.html; Supplier: LCSC; Pin Structure: 1x17P; Pitch: 2.54mm; Row Spacing: 2.54mm; Circluar Pins/Square Pins: Pin Header; Number of Rows: 1; Number of Pins: 17P; Current Rating: 3A; Voltage Rating (Max): 250V; Insulation Height: 2.5mm; Contact Material: Brass; Contact Plating: Gold; Operating Temperature: -40℃~+105℃; Color: Black
H3 = DZ127R-11-02-25: LCSC Part Name: 1x2P 间距:1.27mm 方针 直插; Supplier Part: C2935942; Manufacturer: DEALON(德艺隆); Supplier Footprint: 插件,P=1.27mm; JLCPCB Part Class: Extended Part; Datasheet: https://item.szlcsc.com/datasheet/DZ127R-11-02-25/3287520.html; Supplier: LCSC; Pin Structure: 1x2P; Pitch: 1.27mm; Circluar Pins/Square Pins: Pin Header; Mounting Type: Through Hole; Number of Rows: 1; Number of Pins: 2P; Current Rating: 1A; Length of Mating Pin: 3mm; Insulation Height: 1mm; Length of End Connection Pin: 2.5mm; Contact Material: Brass; Contact Plating: Gold; Color: Black
LED1 = 19-219/GHC-YR2T1B5Y/3T: LCSC Part Name: 0603正贴式 绿灯(Iv=140~360mcd) @IF=20mA); Supplier Part: C2994781; Manufacturer: EVERLIGHT(亿光); Supplier Footprint: 0603; JLCPCB Part Class: Extended Part; Datasheet: https://www.everlighteurope.com/custom/files/datasheets/DSE-0006814.pdf; Supplier: LCSC; Illumination Color: Green; Voltage - Forward(Vf): 2.9V; Power(Watts): 95mW; Forward Current: 5mA; Wavelength - Dominant: 518nm; Peak Wavelength: 525nm; Diode Configuration: Discrete Diode; Lens Color: Water Clear; Luminous Intensity: 360mcd; Viewing Angle: 130°; Operating Temperature: -40℃~+85℃
Q1 Q2 = 2N7002LT1G: LCSC Part Name: 1个N沟道 耐压:60V 电流:115mA; Supplier Part: C16338; Manufacturer: onsemi(安森美); Supplier Footprint: SOT-23; JLCPCB Part Class: Extended Part; Datasheet: https://atta.szlcsc.com/upload/public/pdf/source/20140815/1457707218098.pdf; Supplier: LCSC; Type: 1 N-Channel; Drain Source On Resistance (RDS(on)@Vgs,Id): 7.5Ω@10V,500mA; Gate Threshold Voltage (Vgs(th)@Id): 2.5V@250uA; Input Capacitance (Ciss@Vds): 50pF@25V; Reverse Transfer Capacitance (Crss@Vds): 5pF@25V; Operating Temperature: -55℃~+150℃
Q3 Q4 = PBSS4120T,215: LCSC Part Name: NPN 电流:1A 电压:20V; Supplier Part: C455069; Manufacturer: Nexperia(安世); Supplier Footprint: SOT-23; JLCPCB Part Class: Extended Part; Datasheet: https://item.szlcsc.com/datasheet/PBSS4120T%252C215/457438.html; Supplier: LCSC; type: NPN; Current - Collector(Ic): 1A; Collector - Emitter Voltage VCEO: 20V; Pd - Power Dissipation: 480mW; DC Current Gain: 300@500mA,2V; Transition frequency(fT): 100MHz; Current - Collector Cutoff: 50uA; Vce Saturation(VCE(sat)): 250mV@1A,50mA; Operating Temperature: -65℃~+150℃; Emitter-Base Voltage(Vebo): 5V; Number: 1 NPN
R7-R9 = MF1W-5.1KΩ±1%T: LCSC Part Name: 金属膜电阻 5.1kΩ ±1% 1W; Supplier Part: C714111; Manufacturer: 华星机电; Supplier Footprint: 插件,D4.5xL11.5mm; JLCPCB Part Class: Extended Part; Datasheet: https://item.szlcsc.com/datasheet/MF1W-5.1K%25CE%25A9%25C2%25B11%2525T/754436.html; Supplier: LCSC; Type: Metal Film Resistor; Tolerance: ±1%; Power(Watts): 1W; Temperature Coefficient: ±200ppm/℃
R10-R13 R15 R16 = MF2WS-27Ω±1%: LCSC Part Name: 27Ω ±1% 2W 金属膜电阻; Supplier Part: C127253; Manufacturer: CCO(千志电子); Supplier Footprint: 插件,D4.5xL11.5mm; JLCPCB Part Class: Extended Part; Datasheet: https://atta.szlcsc.com/upload/public/pdf/source/20190910/C427326_62A6D058BC0FF74963A2F22379CA06CE.pdf; Supplier: LCSC; Type: Metal Film Resistors; Tolerance: ±1%; Voltage-Supply(Max): 350V; Power(Watts): 2W; Temperature Coefficient: ±100ppm/℃; Operating Temperature: -55℃~+155℃
R14 = RNF14BTC47K5: LCSC Part Name: 金属膜电阻 47.5kΩ ±0.1% 250mW; Supplier Part: C2592088; Manufacturer: SEI(Stackpole Electronics Inc.); Supplier Footprint: 插件,D2.4xL6.4mm; JLCPCB Part Class: Extended Part; Datasheet: https://atta.szlcsc.com/upload/public/pdf/source/20210416/CE3C3DFE1F0E2A8D22EC743938724C43.pdf; Supplier: LCSC; Type: Metal Film Resistors; Tolerance: ±0.1%; Power(Watts): 0.25W; Temperature Coefficient: ±50ppm/℃; Operating Temperature Range: -55℃~+155℃
SW1 SW2 = TS-1109S-A-C: LCSC Part Name: 4.5*4.5*4.5mm 立贴 轻触开关; Supplier Part: C2885142; Manufacturer: XKB Connection(中国星坤); Supplier Footprint: SMD-4P,4.5x4.5mm; JLCPCB Part Class: Extended Part; Datasheet: https://item.szlcsc.com/datasheet/TS-1109S-A-C/3095634.html; Supplier: LCSC; Circuit: SPST; Actuator Style: Round Button; Operating Force: 1N; Mounting Type: Surface Mount,Vertical; Length: 4.5mm; Width: 4.5mm; Switch Height: 4.5mm; with Bracket: Without Bracket; Contact Current: 50mA; Voltage Rating: 12V; Actuator/Cap Color: Black; With Lamp: No; Termination Style: Gull Wing; Life: 100,000 cycles; Operating Temperature: -30℃~+85℃
U1 = NCP1117LPST33T3G: LCSC Part Name: 输入18V 输出3.3V 1A; Supplier Part: C146799; Manufacturer: onsemi(安森美); Supplier Footprint: SOT-223; JLCPCB Part Class: Extended Part; Datasheet: https://item.szlcsc.com/datasheet/NCP1117LPST33T3G/158131.html; Supplier: LCSC; Output Type: Fixed; Voltage - Supply: 18V; Output Voltage: 3.3V; Output Current: 1A; Power Supply Rejection Ratio (PSRR): 60dB@(120Hz); Voltage Dropout: 1.3V@(1A); standby current: 550uA; Features: Over Temperature Protection；Over Current Protection; Operating Temperature: 0℃~+125℃; Output Configuration: Positive; Number of Outputs: 1
U5 = MF1W-560Ω±1% T: LCSC Part Name: 560Ω ±1% 1W 金属膜电阻; Supplier Part: C119480; Manufacturer: CCO(千志电子); Supplier Footprint: 插件,D4.5xL11.5mm; JLCPCB Part Class: Extended Part; Datasheet: https://item.szlcsc.com/datasheet/MF1W-560%25CE%25A9%25C2%25B11%2525%2520T/120749.html; Supplier: LCSC; Type: Metal Film Resistor; Tolerance: ±1%; Voltage-Supply(Max): 350V; Power(Watts): 1W; Temperature Coefficient: ±100ppm/℃; Operating Temperature: -55℃~+155℃
U7 = X1311WV-03J-C40D24: LCSC Part Name: 1x3P 间距:1.27mm 方针; Supplier Part: C5243683; Manufacturer: XKB Connection(中国星坤); Supplier Footprint: 插件,P=1.27mm; JLCPCB Part Class: Extended Part; Datasheet: https://item.szlcsc.com/datasheet/X1311WV-03J-C40D24/5952616.html; Supplier: LCSC; Pin Structure: 1x3P; Pitch: 1.27mm; Row Spacing: 1.27mm; Circluar Pins/Square Pins: Pin Header; Number of Rows: 1; Number of Pins: 3P; Current Rating: 3A; Voltage Rating (Max): 250V; Insulation Height: 1mm; Contact Material: Brass; Contact Plating: Gold; Operating Temperature: -40℃~+105℃; Color: Black
U8 = ESP32-WROOM-32E-N8: LCSC Part Name: 不带固件 通用型Wi-Fi+BT+BLE MCU模组; Supplier Part: C701342; Manufacturer: ESPRESSIF(乐鑫); Supplier Footprint: SMD,25.5x18mm; JLCPCB Part Class: Extended Part; Datasheet: https://item.szlcsc.com/datasheet/ESP32-WROOM-32E-N8/736350.html; Supplier: LCSC; Utilized IC / Part: ESP32-DOWD-V3; Wireless Standard: Bluetooth4.2; Interface Type: I2C；GPIO；UART；SPI；PWM；SDIO；I2S; Antenna Type: On-board PCB Antenna; Output Power: 20dBm; Voltage - Supply: 3V~3.6V; Receive  Current: 112mA; Send  Current: 239mA; Sensitivity: -98dBm; Operating Temperature: -40℃~+85℃
U9 = GT-USB-7010ASV: LCSC Part Name: Type-C 母 卧贴; Supplier Part: C2988369; Manufacturer: G-Switch(品赞); Supplier Footprint: SMD; JLCPCB Part Class: Extended Part; Datasheet: https://item.szlcsc.com/datasheet/GT-USB-7010ASV/3445595.html; Supplier: LCSC; Connector Type: Type-C; Protocol Standard: USB 2.0; Gender: Female; Mounting Type: Surface Mount, Right Angle; Number of Contacts: 16P; Number of Ports: 1; Current Rating-Power: 3A; Voltage Rating: 24V; Connect-Disconnect Life: 10,000 cycles; Center Height: 1.68mm; Length: 7.35mm; Detection color: Black; Operating Temperature: -40℃~+85℃
U10-U12 = LESD5D5.0CT1G-ES: LCSC Part Name: 普容5.0V，单路双向ESD静电防护器件，30kV，CJ：12pF；音频/视频/通讯防护; Supplier Part: C5199159; Manufacturer: ElecSuper(静芯微); Supplier Footprint: SOD523; JLCPCB Part Class: Extended Part; Datasheet: https://atta.szlcsc.com/upload/public/pdf/source/20240905/10776531C4DE5F6ADA679023752259EC.pdf; Supplier: LCSC; polarity: Bidirectional; Reverse Stand-Off Voltage (Vrwm): 5V; Maximum Clamping Voltage: 10V; Peak Pulse Current (Ipp): 8A; Peak Pulse Power Dissipation (Ppp): 80W; Breakdown Voltage: 5.8V; Reverse Leakage Current (Ir): 1uA; Number of Lines: Single channel; Type: ESD
U13 U14 = CF1W-1KΩ±5%T: LCSC Part Name: 碳膜电阻 1kΩ ±5% 1W; Supplier Part: C714362; Manufacturer: 华星机电; Supplier Footprint: 插件,D4.5xL11.5mm; JLCPCB Part Class: Extended Part; Datasheet: https://item.szlcsc.com/datasheet/CF1W-1K%25CE%25A9%25C2%25B15%2525T/754687.html; Supplier: LCSC; Type: Carbon Film Resistor; Tolerance: ±5%; Power(Watts): 1W; Temperature Coefficient: -1500ppm/℃~+300ppm/℃
U15 U17 U19-U21 = CR-L5W10KΩJ: LCSC Part Name: 水泥电阻 10kΩ ±5% 5W; Supplier Part: C714743; Manufacturer: 华星机电; Supplier Footprint: 插件,D9.5xL22mm; JLCPCB Part Class: Extended Part; Datasheet: https://item.szlcsc.com/datasheet/CR-L5W10K%25CE%25A9J/755068.html; Supplier: LCSC; Type: Cement Resistor; Tolerance: ±5%; Voltage-Supply(Max): 750V; Power(Watts): 5W; Temperature Coefficient: -1500ppm/℃~+300ppm/℃; Operating Temperature: -55℃~+250℃
U16 = CP2102N-A02-GQFN28R: LCSC Part Name: USB转UART桥接器; Supplier Part: C964632; Manufacturer: SKYWORKS/SILICON LABS(芯科); Supplier Footprint: QFN-28-EP(5x5); JLCPCB Part Class: Extended Part; Datasheet: https://item.szlcsc.com/datasheet/CP2102N-A02-GQFN28R/1049893.html; Supplier: LCSC; Applications Function: USB to UART; USB Protocol: USB 2.0; Voltage - Supply: 3V~3.6V; Operating Temperature: -40℃~+85℃@(Ta); Current - Supply: 9.5mA; Quiescent Supply Current: 1.3uA
U18 = RSMF1FT22K1: LCSC Part Name: 金属氧化膜电阻 22.1kΩ ±1% 1W; Supplier Part: C2590508; Manufacturer: SEI(Stackpole Electronics Inc.); Supplier Footprint: 插件,D3.2xL9mm; JLCPCB Part Class: Extended Part; Datasheet: https://atta.szlcsc.com/upload/public/pdf/source/20210417/E7D670218B9E9D0CE2FA9103C376073D.pdf; Supplier: LCSC; Type: Metal Oxide Resistors; Tolerance: ±1%; Power(Watts): 1W; Temperature Coefficient: ±200ppm/℃; Operating Temperature Range: -55℃~+200℃
U22 = NCD0603R6: LCSC Part Name: 片式发光二极管; Supplier Part: C7429910; Manufacturer: 国星光电; Supplier Footprint: 0603; JLCPCB Part Class: Extended Part; Datasheet: https://item.szlcsc.com/datasheet/NCD0603R6/8428631.html; Supplier: LCSC; Illumination Color: Red; Voltage - Forward(Vf): 1.6V~2.4V; Power(Watts): 65mW; Forward Current: 25mA; Wavelength - Dominant: 620nm~630nm; Peak Wavelength: 630nm; Diode Configuration: Discrete Diode; Luminous Intensity: 80mcd; Viewing Angle: 140°; Operating Temperature: -30℃~+85℃
U23 = 红色LED: Supplier Part: C9900005314; Supplier Footprint: LED0603-RD_RED; JLCPCB Part Class: Extended Part; Supplier: LCSC
U24 = AM2302_C55447: Supplier Part: C55447; Manufacturer: 广州奥松; Supplier Footprint: 插件; JLCPCB Part Class: Extended Part; Datasheet: https://atta.szlcsc.com/upload/public/pdf/source/20150811/1457707344116.pdf; Supplier: LCSC

## Nets
+3V3: C2.1 C3.1 C4.2 C5.1 C7.1 C10.1 C11.2 H1.2 H2.2 H3.1 R7.2 U1.2(VOUT) U1.4(EP) U5.2 U8.2(3V3) U13.2 U16.6(VDD) U16.7(VREGIN) U19.2 U24.1(VDD)
+5V: C1.1 U1.3(VIN) U7.3
+5V_EXT: C6.1 H1.16 U7.2
+5V_VBUS: D1.1(C) U7.1 U10.2 U18.1
GND: C1.2 C2.2 C3.2 C4.1 C5.2 C6.2 C7.2 C8.2 C9.2 C10.2 C11.1 C12.2 C13.2 H1.1 H1.15 H2.1 H2.8 LED1.2(K) Q1.2(S) Q2.2(S) R8.1 R9.1 R14.1 SW1.3 SW1.4 SW2.3 SW2.4 U1.1(ADJ/GND) U8.1(GND) U8.15(GND) U8.38(GND) U8.39(GND) U9.1(SHELL) U9.2(SHELL) U9.3(SHELL) U9.4(SHELL) U9.A1B12(GND) U9.B1A12(GND) U10.1 U11.1 U12.1 U15.1 U16.3(GND) U16.29(EP) U17.1 U24.4(GND)
NET1: U22.1(-)
NET2: U8.9(IO33)
NET3: U8.3(EN)
NET4: U8.4(SENSOR_VP)
NET5: U8.5(SENSOR_VN)
NET6: U8.6(IO34)
NET7: U8.7(IO35)
NET8: U8.34(RXD0)
NET9: U8.35(TXD0)
NET10: U8.25(IO0)
NET11: U8.24(IO2)
NET12: U8.26(IO4)
NET13: U8.14(IO12)
NET14: U8.13(IO14)
NET15: U8.16(IO13)
NET16: U8.23(IO15)
NET17: U8.27(IO16)
NET18: U8.28(IO17)
NET19: U8.29(IO5)
NET20: U8.30(IO18)
NET21: U8.31(IO19)
NET22: U8.33(IO21)
NET23: U8.36(IO22)
NET24: U8.37(IO23)
NET25: U8.10(IO25)
NET26: U8.11(IO26)
NET27: U8.12(IO27)
NET28: U8.8(IO32)
NET29: R10.1 R11.1
NET30: R10.2
NET31: R11.2
NET32: H1.3
NET33: H1.4
NET34: H1.5
NET35: H1.6
NET36: H1.7
NET37: H1.8
NET38: H1.9
NET39: H1.10
NET40: H1.11
NET41: H1.12
NET42: H1.13 U24.2(SDA)
NET43: H1.14
NET44: H1.17
NET45: H2.3
NET46: H2.4
NET47: H2.5
NET48: H2.6
NET49: H2.7
NET50: H2.9
NET51: H2.10
NET52: H2.11
NET53: H2.12
NET54: H2.13
NET55: H2.14
NET56: H2.15
NET57: H2.16
NET58: H2.17
NET59: Q1.3(D) R12.2
NET60: Q2.3(D) R13.1
NET61: U14.1
NET62: U16.4(D+)
NET63: U16.5(D-)
NET64: U16.25(RXD)
NET65: U16.26(TXD)
NET66: U16.28(DTR)
NET67: U16.24(RTS)
NET68: C12.1 C13.1 SW1.1 SW1.2 SW2.1 SW2.2 U19.1
NET69: R15.2
NET70: R15.1
NET71: R16.2
NET72: R16.1
NET73: Q4.3(C) U20.2
NET74: Q3.2(E) U21.2
NET75: Q3.3(C)
NET76: Q4.2(E)
Net-(C8-1): C8.1 D1.2(A) U9.A4B9(VBUS) U9.B4A9(VBUS)
Net-(C9-1): C9.1 H3.2
Net-(LED1-1): LED1.1(A) R7.1
Net-(Q1-1): Q1.1(G) Q2.1(G) U14.2 U15.2
Net-(Q3-1): Q3.1(B) U20.1
Net-(Q4-1): Q4.1(B) U21.1
Net-(R8-2): R8.2 U9.A5(CC1)
Net-(R9-2): R9.2 U9.B5(CC2)
Net-(R12-1): R12.1 U9.A6(DP1) U9.B6(DP2) U11.2
Net-(R13-2): R13.2 U9.A7(DN1) U9.B7(DN2) U12.2
Net-(R14-2): R14.2 U16.8(VBUS) U18.2
Net-(U5-1): U5.1 U22.2(+)
Net-(U13-1): U13.1 U16.9(RSTb)
Net-(U16-11): U16.11(SUSPENDb) U17.2

Not connected (* = marked no-connect by the designer): U8 17(NC)* 18(NC)* 19(NC)* 20(NC)* 21(NC)* 22(NC)* 32(NC)*; U9 A8(SBU1)* B8(SBU2)*; U16 1(DCD)* 2(RI/CLK)* 10(NC)* 12(SUSPEND)* 13(CHREN)* 14(CHR1)* 15(CHR0)* 16(GPIO.3/WAKEUP)* 17(GPIO.2/RS485)* 18(GPIO.1/RXT)* 19(GPIO.0/TXT)* 20(GPIO.6)* 21(GPIO.5)* 22(GPIO.4)* 23(CTS)* 27(DSR)*; U23 1(K) 2(A); U24 3(NC)*
